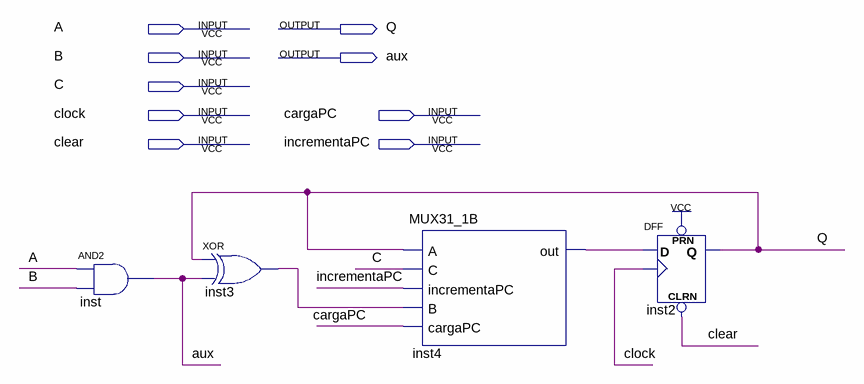
[diagram p0: schematic sheet]
// Quartus schematic AuxSomador.bdf as structural Verilog: 4 symbols, 9 pins
module AuxSomador (
  input  A,
  input  B,
  input  C,
  input  clock,
  input  cargaPC,
  input  clear,
  input  incrementaPC,
  output Q,
  output aux
);

  wire inst3_out, inst4_out;

  and inst (aux, A, B);
  xor inst3 (inst3_out, Q, aux);
  MUX31_1B inst4 (.A(Q), .C(C), .incrementaPC(incrementaPC), .B(inst3_out), .cargaPC(cargaPC), .out(inst4_out));
  DFF inst2 (.CLRN(clear), .CLK(clock), .D(inst4_out), .PRN(1'b1), .Q(Q));
endmodule
